# EAGLE design chuveiro (EAGLE 7.2.0)
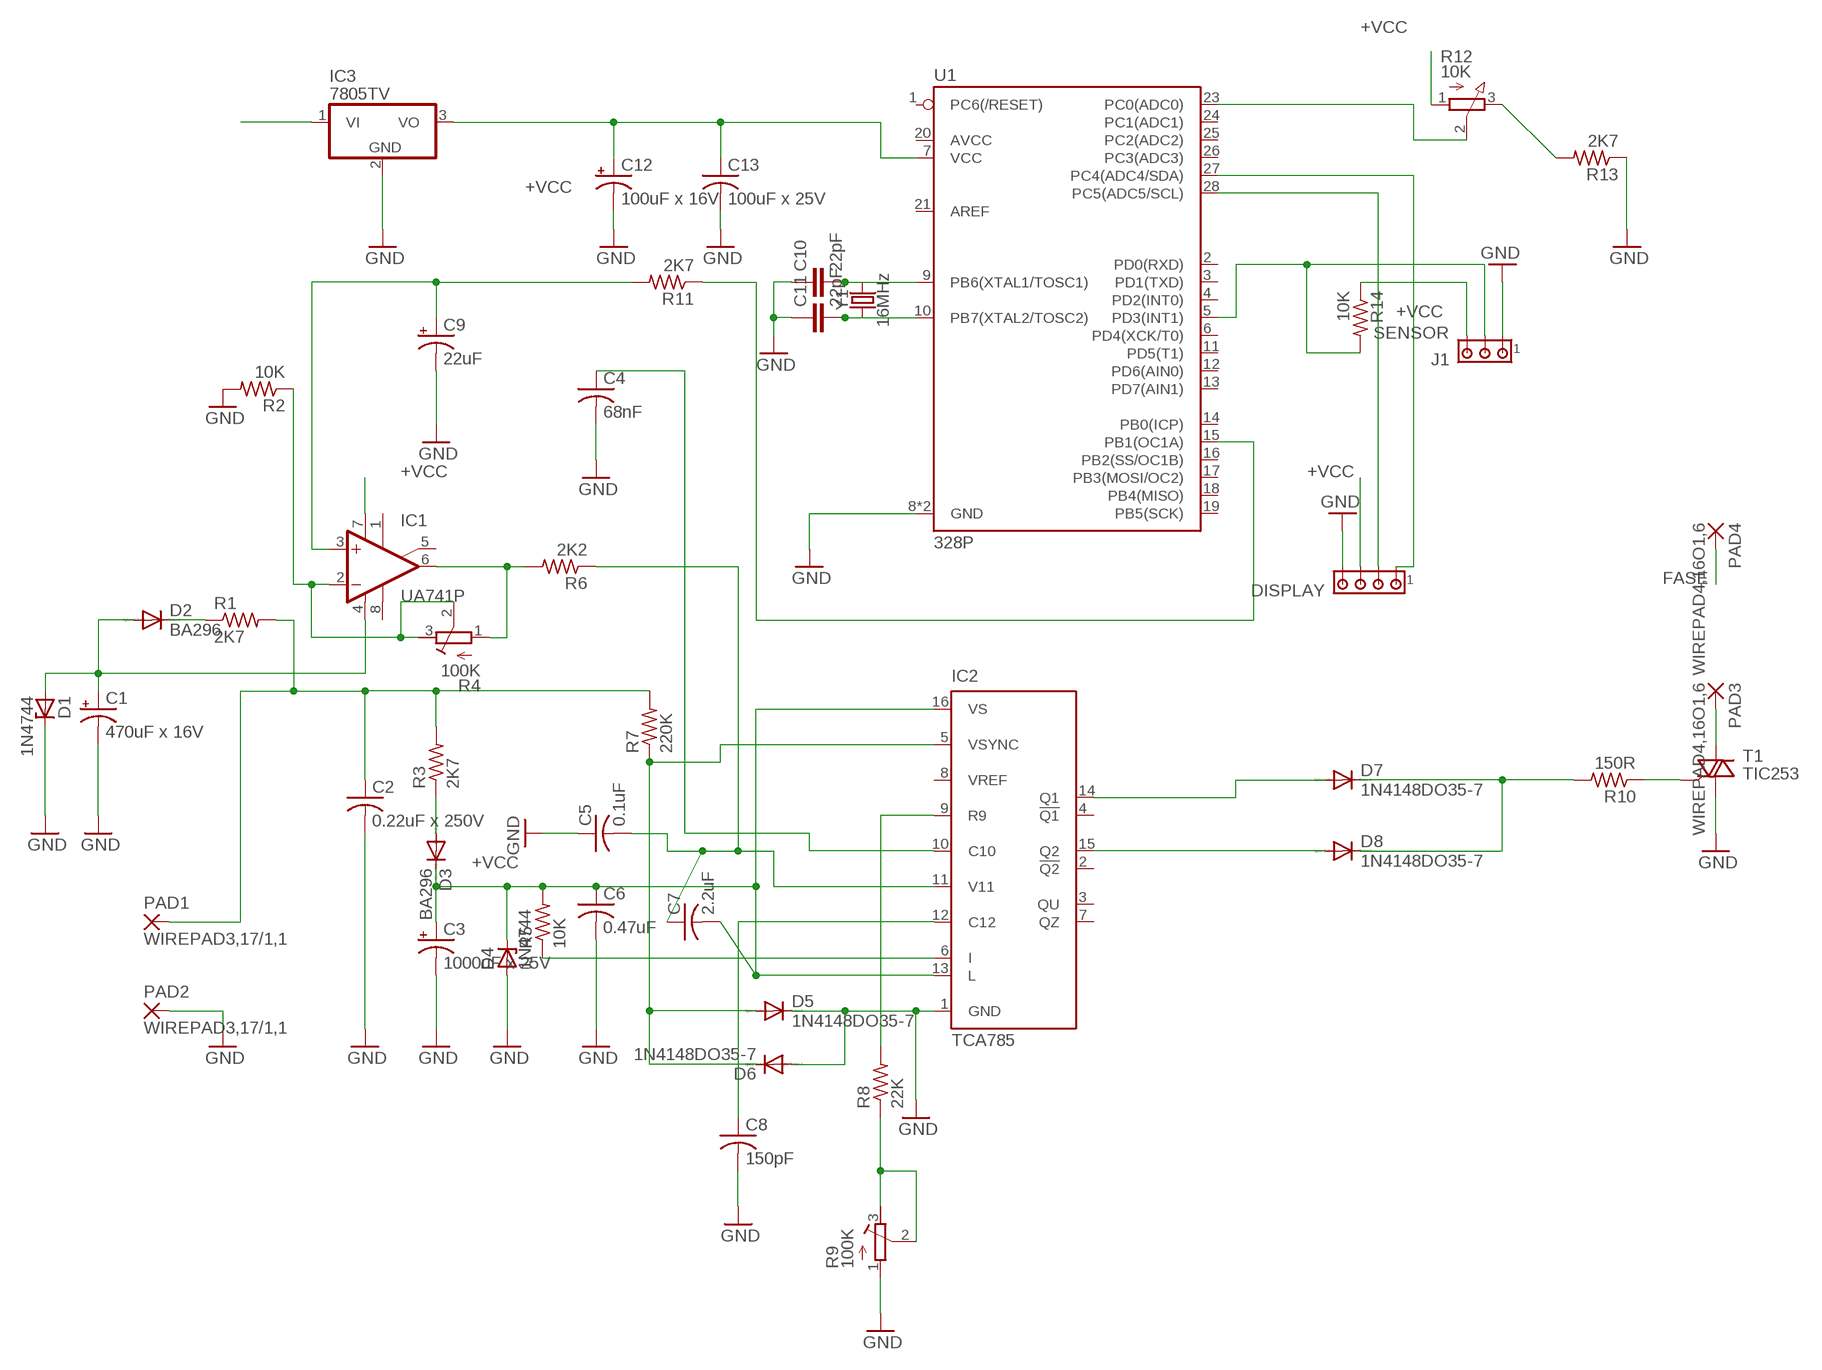
[diagram p0: schematic, sheet 1]

## Parts
C1  470uF x 16V  CPOL-USE5-6  [E5-6]
C2  0.22uF x 250V  C-US225-062X268  [C225-062X268]
C3  1000uF x 25V  CPOL-USE5-6  [E5-6]
C4  68nF  C-US025-050X050  [C025-050X050]
C5  0.1uF  C-US025-050X050  [C025-050X050]
C6  0.47uF  C-US025-050X050  [C025-050X050]
C7  2.2uF  C-US025-050X050  [C025-050X050]
C8  150pF  C-US025-050X050  [C025-050X050]
C9  22uF  CPOL-USE5-6  [E5-6]
C10  22pF  C-EU025-024X044  [C025-024X044]
C11  22pF  C-EU025-024X044  [C025-024X044]
C12  100uF x 16V  CPOL-USE5-6  [E5-6]
C13  100uF x 25V  C-US225-062X268  [C225-062X268]
D1  1N4744  ZENER-DIODEDO41Z10  [DO41Z10]
D2  BA296  [P2-15]
D3  BA296  [P2-15]
D4  1N4744  ZENER-DIODEDO41Z10  [DO41Z10]
D5  1N4148DO35-7  [DO35-7]
D6  1N4148DO35-7  [DO35-7]
D7  1N4148DO35-7  [DO35-7]
D8  1N4148DO35-7  [DO35-7]
DISPLAY  MTA04-100  [10X04MTA]
IC1  UA741P  [DIL08]
IC2  TCA785  [DIL16]
IC3  7805TV  [TO220V]
J1  SENSOR  MTA03-100  [10X03MTA]
PAD1  WIREPAD3,17/1,1  [3,17/1,1]
PAD2  WIREPAD3,17/1,1  [3,17/1,1]
PAD3  WIREPAD4,16O1,6  [4,16O1,6]
PAD4  WIREPAD4,16O1,6  [4,16O1,6]
R1  2K7  R-US_0207/10  [0207/10]
R2  10K  R-US_0207/10  [0207/10]
R3  2K7  R-US_0207/10  [0207/10]
R4  100K  R-TRIMM64Y  [RTRIM64Y]
R5  10K  R-US_0207/10  [0207/10]
R6  2K2  R-US_0207/10  [0207/10]
R7  220K  R-US_0207/10  [0207/10]
R8  22K  R-US_0207/10  [0207/10]
R9  100K  R-TRIMM64Y  [RTRIM64Y]
R10  150R  R-US_0207/10  [0207/10]
R11  2K7  R-US_0207/10  [0207/10]
R12  10K  3RP/1610N  [3RP/1610N]
R13  2K7  R-US_0207/10  [0207/10]
R14  10K  R-US_0207/10  [0207/10]
T1  TIC253  [TO218DS]
U1  328P  ATMEGA328P_PDIP  [DIP28]
Y1  16MHz  CRYSTAL-16MHZPTH-HC49US  [HC49US]

## Nets
+VCC: C3.+ C6.1 C7.2 D3.C D4.C DISPLAY.3 IC1.7(V+) IC2.13(L) IC2.16(VS) IC3.1(VI) J1.3 R5.2 R12.1(A) R14.1
FASE: C2.1 PAD1.1(P) PAD4.1(P) R1.2 R3.2 R7.2
GND: C1.- C2.2 C3.- C4.2 C5.1 C6.2 C8.2 C9.- C10.1 C11.1 C12.- C13.2 D1.C D4.A D5.C D6.A DISPLAY.4 IC2.1(GND) IC3.2(GND) J1.1 PAD2.1(P) R2.2 R9.1(A) R13.1 T1.A1 U1.8(GND) U1.22(GND)
N$1: D3.A R3.1
N$2: C8.1 IC2.12(C12)
N$3: R11.1 U1.15(PB1(OC1A))
N$5: D5.A D6.C IC2.5(VSYNC) R7.1
N$6: IC2.6(I) R5.1
N$7: C9.+ IC1.3(+IN) R11.2
N$8: C5.2 C7.1 IC2.11(V11) R6.1
N$9: C11.2 U1.10(PB7(XTAL2/TOSC2)) Y1.1
N$10: C4.1 IC2.10(C10)
N$11: D7.A IC2.14(Q1)
N$12: D8.A IC2.15(Q2)
N$13: D7.C D8.C R10.2
N$14: R10.1 T1.G
N$15: R8.1 R9.2(S) R9.3(E)
N$16: IC2.9(R9) R8.2
N$17: IC1.6(OUT) R4.1(A) R6.2
N$18: D2.C R1.1
N$19: C1.+ D1.A D2.A IC1.4(V-)
N$20: IC1.2(-IN) R2.1 R4.2(S) R4.3(E)
N$21: C10.2 U1.9(PB6(XTAL1/TOSC1)) Y1.2
N$22: R12.3(E) R13.2
N$23: R12.2(S) U1.23(PC0(ADC0))
N$24: C12.+ C13.1 IC3.3(VO) U1.7(VCC)
N$25: J1.2 R14.2 U1.5(PD3(INT1))
N$26: DISPLAY.2 U1.28(PC5(ADC5/SCL))
N$27: DISPLAY.1 U1.27(PC4(ADC4/SDA))
N$28: PAD3.1(P) T1.A2
Unconnected: IC1.1(ON1) IC1.5(ON2) IC1.8(OPT) IC2.2(!Q2) IC2.3(QU) IC2.4(!Q1) IC2.7(QZ) IC2.8(VREF) U1.1(PC6(/RESET)) U1.2(PD0(RXD)) U1.3(PD1(TXD)) U1.4(PD2(INT0)) U1.6(PD4(XCK/T0)) U1.11(PD5(T1)) U1.12(PD6(AIN0)) U1.13(PD7(AIN1)) U1.14(PB0(ICP)) U1.16(PB2(SS/OC1B)) U1.17(PB3(MOSI/OC2)) U1.18(PB4(MISO)) U1.19(PB5(SCK)) U1.20(AVCC) U1.21(AREF) U1.24(PC1(ADC1)) U1.25(PC2(ADC2)) U1.26(PC3(ADC3))

## Library data of the parts
C1 C3 C9 C12 = rcl:CPOL-US: POLARIZED CAPACITOR, American symbol
C2 C4-C8 C13 = rcl:C-US: CAPACITOR, American symbol
C10 C11 = rcl:C-EU: CAPACITOR, European symbol
D1 D4 = diode:ZENER-DIODE: Z-Diode
D2 D3 = diode:BA296: DIODE
D5-D8 = diode:1N4148: DIODE high speed (Philips)
DISPLAY = con-amp:MTA04-100: AMP connector
IC1 = linear:*741: OP AMP
IC2 = infineon:TCA785: Phase Control IC Source: http://www.infineon.com/ .. tca785.pdf; OC_FARNELL: unknown; OC_NEWARK: unknown
IC3 = linear:78*: Positive VOLTAGE REGULATOR Source: http://cache.national.com/ds/LM/LM78L05.pdf http://www.fairchildsemi.com/ds/LM/LM7805.pdf
J1 = con-amp:MTA03-100: AMP connector
PAD1-PAD4 = wirepad:WIREPAD: Wire PAD connect wire on PCB
R1-R3 R5-R8 R11 R13 R14 = rcl:R-US_: RESISTOR, American symbol
R4 R9 = rcl:R-TRIMM: Trimm resistor
R10 = resistor:R-US_: RESISTOR, American symbol
R12 = pot:3RP/1610N: 16mm Potentiometer one level Source: http://www.alphapotentiometers.net/html/16mm_pot_2.html
T1 = triac:TIC253: TRIAC
U1 = SparkFun-IC-Microcontroller:ATMEGA328P_PDIP: Atmel 328P Through hole ATMEGA328P uC used in the Arduino 32kb flash, 1k EEPROM, 2k SRAM Datasheet <http://www.sparkfun.com/datasheets/Components/SMD/ATMega328.pdf> SparkFun Products Storefront component: AVR 28 Pin 20MHz 32K 6A/D - ATMega328P <https://www.sparkfun.com/products/9061> (COM-09061) SparkFun Simon Says - Through-Hole Soldering Kit <https://www.sparkfun.com/products/10547> (KIT-10547) SparkFun Learn to Solder - Simon Says <https://www.sparkfun.com/products/13708> (KIT-13708) SparkFun BigTime Watch Kit <https://www.sparkfun.com/products/11734> (KIT-11734) SparkFun ClockIt <https://www.sparkfun.com/products/10930> (KIT-10930) SparkFun Serial Enabled LCD Kit <https://www.sparkfun.com/products/10097> (LCD-10097) SparkFun Simon Tilts - Through Hole Soldering Kit <https://www.sparkfun.com/products/12634> (KIT-12634) SparkFun Frequency Counter Kit <https://www.sparkfun.com/products/10140> (KIT-10140) FabFM Radio Kit <https://www.sparkfun.com/products/11043> (KIT-11043) SparkFun Binary Blaster Kit <https://www.sparkfun.com/products/12037> (KIT-12037) SparkFun Metro-Gnome <https://www.sparkfun.com/products/9236> (KIT-09236) ATmega328 with Arduino Optiboot (Uno) <https://www.sparkfun.com/products/10524> (DEV-10524); PROD_ID: IC-09136
Y1 = SparkFun-Clocks:CRYSTAL-16MHZ: 16MHz Crystal Digikey Example <http://www.digikey.com/product-search/en?keywords=535-9122-1-ND> Frequency: 16MHz Frequency Stability: ±50ppm Frequency Tolerance: ±20ppm Load Capacitance: 18pF SparkFun Products: Pro Micro -5V/16MHz <https://www.sparkfun.com/products/12640> SparkFun Serial Enabled LCD Kit <https://www.sparkfun.com/products/10097>; PROD_ID: XTAL-08181; SF_ID: COM-00536

## Board
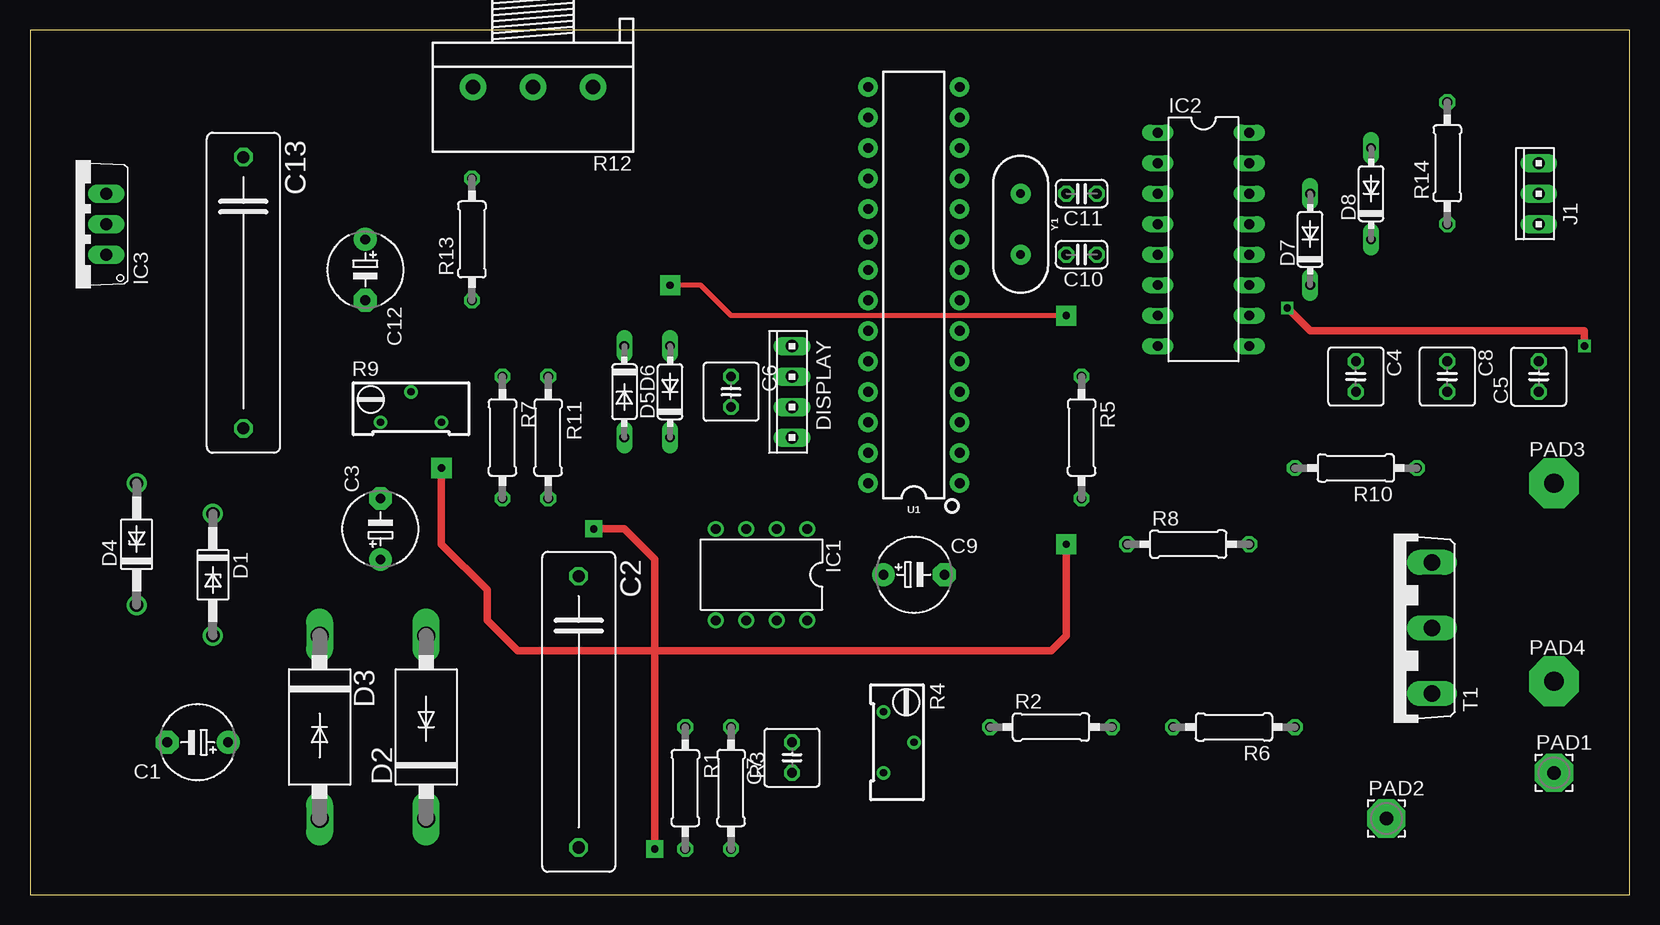
[diagram p1: board, top side]
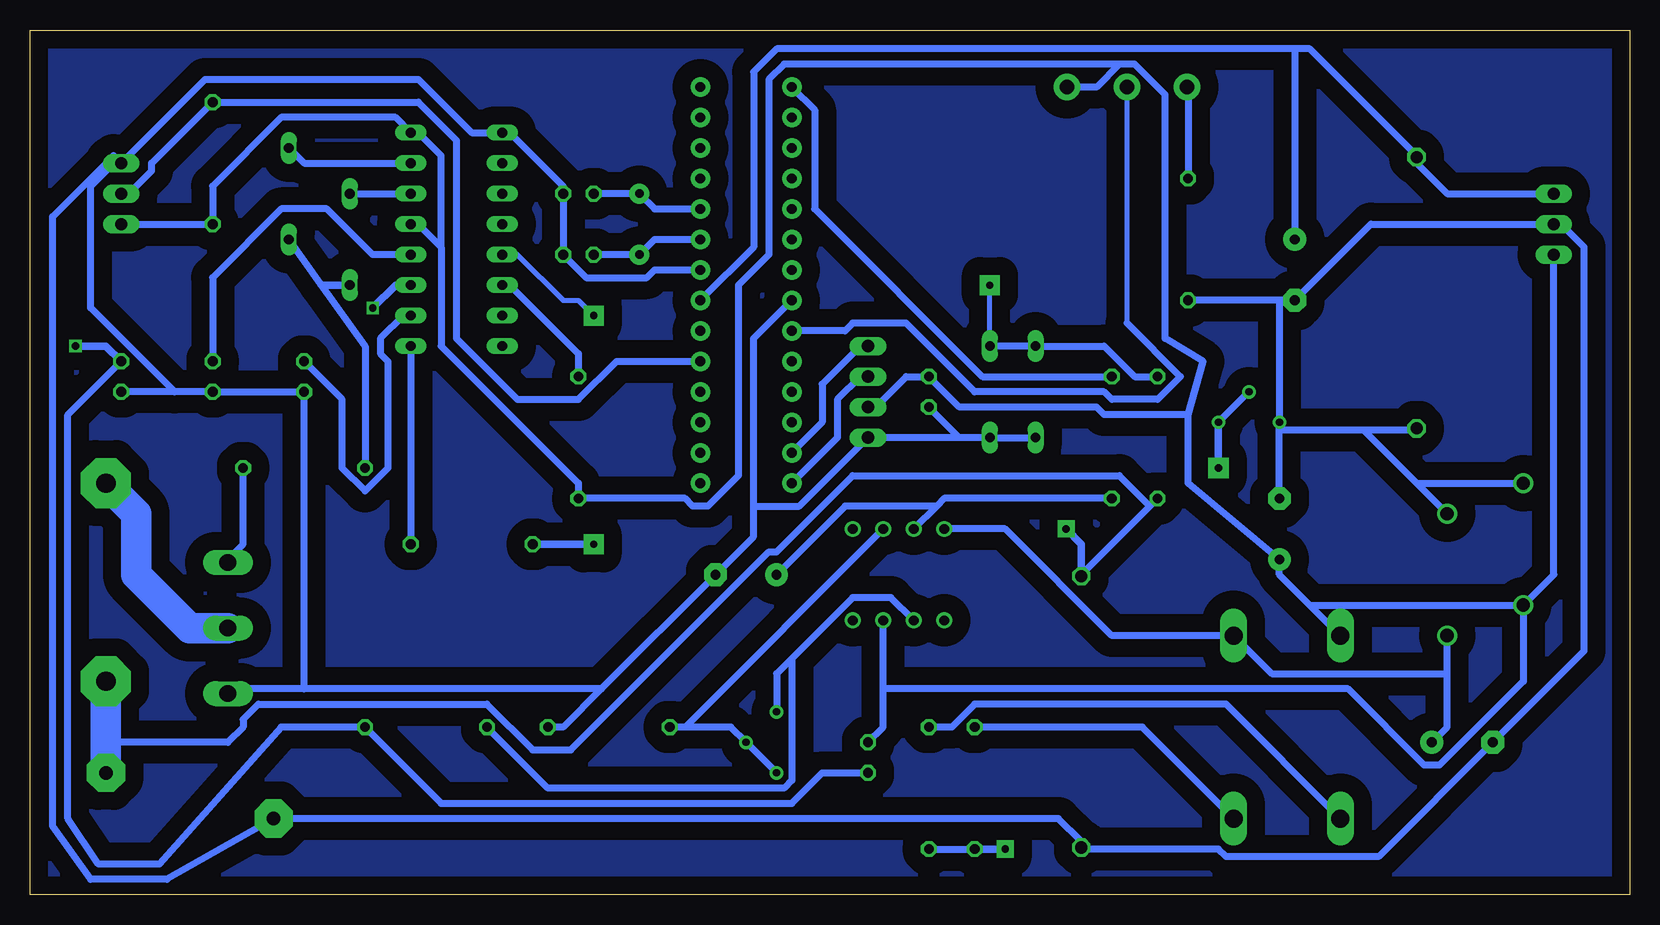
[diagram p2: board, bottom side, seen from below]

Size 133.33 x 72.06 mm. Coordinates in mm from the lower left corner, seen from the top.
Outline: 0,0 133.33,0 133.33,72.06 0,72.06 0,0
Copper layers (1*16): Top 0.035mm / dielectric 1.5mm / Bottom 0.035mm
Design rules "default *": minimum track width 0.6mm, minimum drill 24mil, track to track 15mil, track to pad 10mil, pad to pad 8mil, via to via 8mil, smd to smd 8mil, copper to edge 40mil, drill to drill 8mil, minimum pad ring 10mil, minimum via ring 8mil, stop-mask expansion 4mil, vias tented up to drill 0mil, thermal gap 10mil

### Footprints (pad centres in the part's own frame; a part is rotated, then mirrored left to right if it is on the bottom)
E5-6 = drill 0.813 pad 1.905: + -2.54,0 | drill 0.813 pad 1.905 octagon: - 2.54,0
C225-062X268 = drill 1.016 octagon: 1 -11.303,0; 2 11.303,0
C025-050X050 = drill 0.813 octagon: 1 -1.27,0; 2 1.27,0
C025-024X044 = drill 0.813 octagon: 1 -1.27,0; 2 1.27,0
DO41Z10 = drill 1.118: A 5.08,0; C -5.08,0
P2-15 = drill 1.499 long: A 7.62,0; C -7.62,0
DO35-7 = drill 0.813 long: A 3.81,0; C -3.81,0
10X04MTA = drill 1.016 long: 1 3.81,0; 2 1.27,0; 3 -1.27,0; 4 -3.81,0
DIL08 = drill 0.813 pad 1.27: 1 -3.81,-3.81; 2 -1.27,-3.81; 3 1.27,-3.81; 4 3.81,-3.81; 5 3.81,3.81; 6 1.27,3.81; 7 -1.27,3.81; 8 -3.81,3.81
DIL16 = drill 0.813 long: 1 -8.89,-3.81; 2 -6.35,-3.81; 3 -3.81,-3.81; 4 -1.27,-3.81; 5 1.27,-3.81; 6 3.81,-3.81; 7 6.35,-3.81; 8 8.89,-3.81; 9 8.89,3.81; 10 6.35,3.81; 11 3.81,3.81; 12 1.27,3.81; 13 -1.27,3.81; 14 -3.81,3.81; 15 -6.35,3.81; 16 -8.89,3.81
TO220V = drill 1.016 long: 1 -2.54,-2.54; 2 0,-2.54; 3 2.54,-2.54
10X03MTA = drill 1.016 long: 1 2.54,0; 2 0,0; 3 -2.54,0
3,17/1,1 = drill 1.118 pad 3.175 octagon: 1 0,0
4,16O1,6 = drill 1.6 pad 4.166 octagon: 1 0,0
0207/10 = drill 0.813 octagon: 1 -5.08,0; 2 5.08,0
RTRIM64Y = drill 0.61: 1 0,-2.54; 2 -2.54,0; 3 0,2.54
3RP/1610N = drill 1.2 pad 2.184: 1 -5,0; 2 0,0; 3 5,0
TO218DS = drill 1.397 long: A1 -5.461,-3.175; A2 0,-3.175; G 5.461,-3.175
DIP28 = drill 0.813 pad 1.626: 1 -16.51,-3.81; 2 -13.97,-3.81; 3 -11.43,-3.81; 4 -8.89,-3.81; 5 -6.35,-3.81; 6 -3.81,-3.81; 7 -1.27,-3.81; 8 1.27,-3.81; 9 3.81,-3.81; 10 6.35,-3.81; 11 8.89,-3.81; 12 11.43,-3.81; 13 13.97,-3.81; 14 16.51,-3.81; 15 16.51,3.81; 16 13.97,3.81; 17 11.43,3.81; 18 8.89,3.81; 19 6.35,3.81; 20 3.81,3.81; 21 1.27,3.81; 22 -1.27,3.81; 23 -3.81,3.81; 24 -6.35,3.81; 25 -8.89,3.81; 26 -11.43,3.81; 27 -13.97,3.81; 28 -16.51,3.81
HC49US = drill 0.7 pad 1.651: 1 -2.54,0; 2 2.54,0

### Placement (x,y rotation side)
C1  13.97,12.7 180 top
C2  45.72,15.24 270 top
C3  29.21,30.48 90 top
C4  110.49,43.18 270 top
C5  125.73,43.18 90 top
C6  58.42,41.91 270 top
C7  63.5,11.43 90 top
C8  118.11,43.18 270 top
C9  73.66,26.67 0 top
C10  87.63,53.34 180 top
C11  87.63,58.42 180 top
C12  27.94,52.07 270 top
C13  17.78,50.16 270 top
D1  15.24,26.67 270 top
D2  33.02,13.97 90 top
D3  24.13,13.97 270 top
D4  8.89,29.21 90 top
D5  53.34,41.91 90 top
D6  49.53,41.91 270 top
D7  106.68,54.61 90 top
D8  111.76,58.42 90 top
DISPLAY  63.5,41.91 90 top
IC1  60.96,26.67 180 top
IC2  97.79,54.61 270 top
IC3  3.81,55.88 90 top
J1  125.73,58.42 90 top
PAD1  127,10.16 0 top
PAD2  113.03,6.35 0 top
PAD3  127,34.29 0 top
PAD4  127,17.78 0 top
R1  54.61,8.89 270 top
R2  85.09,13.97 0 top
R3  58.42,8.89 270 top
R4  71.12,12.7 180 top
R5  87.63,38.1 270 top
R6  100.33,13.97 180 top
R7  39.37,38.1 270 top
R8  96.52,29.21 0 top
R9  31.75,39.37 270 top
R10  110.49,35.56 180 top
R11  43.18,38.1 270 top
R12  41.91,67.31 180 top
R13  36.83,54.61 90 top
R14  118.11,60.96 90 top
T1  113.67,22.23 90 top
U1  73.66,50.8 90 top
Y1  82.55,55.88 270 top

### Tracks (layer width: path | path; a pad name or v marks a point on that pad's centre or on a via)
+VCC
  Bottom 0.6: 62.23,17.15 62.23,13.97 C7.2 | 62.23,17.15 IC1.7 | IC3.1 6.35,26.67 D4.C | 62.23,17.15 23.5,17.15 17.14,10.79 15.88,10.79 8.89,17.78 D4.C | J1.3 R14.1 118.11,59.05 112.4,64.77 102.87,64.77 IC2.16 100.97,63.5 99.06,61.59 99.06,53.98 | 99.06,53.98 99.06,45.72 87.63,34.29 R5.2 78.74,33.02 78.11,32.38 76.84,32.38 74.3,34.92 74.3,50.8 71.76,53.34 71.76,67.95 70.48,69.22 42.54,69.22 | 99.06,53.98 100.97,55.88 IC2.13 | DISPLAY.3 62.87,40.64 60.32,43.18 C6.1 55.88,40.64 44.45,40.64 43.81,40 36.83,40 | D3.C 26.67,24.13 | 26.67,24.13 29.21,26.67 C3.+ 36.83,34.29 36.83,40 | R12.1 44.45,67.31 42.54,69.22 | 42.54,69.22 41.27,69.22 38.73,66.68 38.73,46.35 35.56,44.45 36.83,40 | 26.67,24.13 D4.C
FASE  (via drill 0.6 pad 1.42)
  Top 0.61: v46.99,30.48 49.53,30.48 52.07,27.94 v52.07,3.81
  Bottom 0.6: 40,32.38 45.72,26.67 C2.1 | 40,32.38 R7.2 | 40,32.38 42.54,34.92 64.77,34.92 71.12,28.57 71.76,28.57 88.27,12.06 91.44,12.06 95.25,15.88 114.3,15.88 115.57,14.6 115.57,13.97 116.84,12.7 127,12.7 | R3.2 R1.2
  Bottom 0.61: C2.1 45.72,29.21 v46.99,30.48 | v52.07,3.81 R1.2
  Bottom 2.54: PAD1.1 127,12.7 PAD4.1
GND
  Bottom 0.6: U1.8 81.28,52.07 81.92,51.43 87,51.43 C10.1 C11.1 88.9,59.05 93.34,63.5 IC2.1 96.52,63.5 100.97,67.95 118.75,67.95 J1.1 | 121.29,41.91 C8.2 C4.2 110.49,17.15 | 121.29,41.91 C5.1 | J1.1 126.37,60.96 128.27,59.05 128.27,48.89 121.29,41.91 | D6.A D5.C 55.88,38.1 | 55.88,38.1 C6.2 | 55.88,38.1 DISPLAY.4 69.22,32.38 73.03,32.38 | R2.2 88.9,13.97 85.73,17.15 | 85.73,17.15 C9.- 73.03,29.84 73.03,32.38 | U1.22 73.03,46.35 73.03,32.38 | 85.73,17.15 110.49,17.15 | 110.49,17.15 116.84,17.15 T1.A1 | C3.- 29.21,38.73 | 29.21,38.73 22.23,38.73 | 22.23,38.73 17.78,38.73 C13.2 | 29.21,38.73 R9.1 29.21,49.53 | 22.23,38.73 17.78,34.29 | 17.78,34.29 D1.C | 17.78,34.29 D4.A | 29.21,49.53 C12.- 21.59,55.88 IC3.2 5.71,55.88 3.81,53.98 3.81,20.32 C1.- 20.96,3.18 33.65,3.18 34.29,3.81 45.72,3.81 C2.2 45.72,4.45 47.62,6.35 PAD2.1 121.92,1.27 128.27,1.27 131.44,5.71 131.44,56.52 126.37,61.59 J1.1 | 29.21,49.53 R13.1
N$1
  Bottom 0.6: R3.1 56.51,13.97 54.61,15.88 33.65,15.88 D3.A
N$2
  Bottom 0.6: C8.1 118.11,51.43 112.4,57.15 108.59,57.15 104.78,53.34 IC2.12
N$3
  Bottom 0.6: R11.1 53.97,43.18 67.95,57.15 67.95,65.41 U1.15
N$4  (via drill 0.6 pad 1.68)
  other vias: 86.36,48.26
N$5  (via drill 0.6 pad 1.68)  (1 unrouted)
  Top 0.406: v86.36,48.26 58.42,48.26 55.88,50.8 53.34,50.8
  Bottom 0.406: D5.A 53.34,50.8 | IC2.5 92.71,53.34 88.9,49.53 87.63,49.53 v86.36,48.26
  Bottom 0.6: R7.1 41.27,43.18 43.81,45.72 D6.C D5.A
N$6
  Bottom 0.6: R5.1 87.63,45.09 93.34,50.8 IC2.6
N$7
  Bottom 0.6: 57.78,32.38 57.15,33.02 R11.2 | 57.78,32.38 IC1.3 | C9.+ 65.41,32.38 57.78,32.38
N$8  (via drill 0.6 pad 1.02)
  Top 0.61: v104.78,48.89 106.68,46.99 129.54,46.99 v129.54,45.72
  Bottom 0.6: C7.1 67.31,10.16 69.85,7.62 99.06,7.62 R6.1 112.4,13.97 122.56,2.54 127.64,2.54 130.17,6.35 130.17,40 C5.2
  Bottom 0.61: IC2.11 102.87,50.8 v104.78,48.89 | v129.54,45.72 127,45.72 C5.2
N$9
  Bottom 0.6: C11.2 Y1.1 81.28,57.15 U1.10
N$10
  Bottom 0.6: C4.1 107.31,41.27 107.31,35.56 105.41,33.66 103.51,35.56 103.51,44.45 104.14,45.09 104.14,46.35 102.23,48.26 IC2.10
N$11
  Bottom 0.6: D7.A IC2.14
N$12
  Bottom 0.6: IC2.15 110.49,60.96 D8.A
N$13
  Bottom 0.6: R10.2 105.41,45.72 109.1,50.89 D8.C
  Bottom 0.61: D7.C 109.01,50.8 109.1,50.89
N$14
  Bottom 0.6: R10.1 115.57,29.21 116.84,27.94 T1.G
N$15  (via drill 0.6 pad 1.68)
  Top 0.61: v86.36,29.21 86.36,21.59 85.09,20.32 40.64,20.32 38.1,22.86 38.1,25.4 34.29,29.21 v34.29,35.56
  Bottom 0.6: R9.3 R9.2
  Bottom 0.61: R8.1 v86.36,29.21 | v34.29,35.56 R9.3
N$16
  Bottom 0.6: IC2.9 R8.2
N$17
  Bottom 0.6: R4.1 71.12,18.41 69.85,19.69 | 69.85,19.69 64.77,24.77 61.59,24.77 IC1.6 | R6.2 90.17,8.89 70.48,8.89 69.85,9.53 69.85,19.69
N$18
  Bottom 0.6: R1.1 40.64,13.97 D2.C
N$19
  Bottom 0.6: 15.24,18.41 15.24,13.97 C1.+ | 15.24,18.41 D1.A | IC1.4 52.07,30.48 43.18,21.59 D2.A 29.84,18.41 15.24,18.41
N$20
  Bottom 0.6: R4.3 R4.2 74.93,13.97 78.74,13.97 | 78.74,13.97 R2.1 | 78.74,13.97 IC1.2
N$21
  Bottom 0.6: C10.2 Y1.2 81.28,54.61 U1.9
N$22
  Bottom 0.6: R13.2 36.83,67.31 R12.3
N$23
  Bottom 0.406: 41.91,47.62 R12.2
  Bottom 0.6: U1.23 65.41,46.99 64.77,47.62 60.32,47.62 54.61,41.91 43.81,41.91 43.18,41.27 39.37,41.27 37.46,43.18 41.91,47.62
N$24
  Bottom 0.6: U1.7 73.03,53.98 73.03,68.58 71.12,70.48 27.94,70.48 | 27.94,70.48 26.67,70.48 17.78,61.59 C13.1 17.78,60.96 15.24,58.42 IC3.3 | 27.94,70.48 C12.+
N$25
  Bottom 0.6: J1.2 125.09,58.42 123.19,60.32 123.19,60.96 R14.2 100.97,66.04 97.79,62.87 97.79,46.35 92.71,41.27 87.63,41.27 84.45,44.45 U1.5
N$26
  Bottom 0.6: U1.28 66.04,38.1 66.04,41.27 64.14,43.18 DISPLAY.2
N$27
  Bottom 0.6: U1.27 67.31,39.37 67.31,42.55 64.14,45.72 DISPLAY.1
N$28
  Bottom 2.54: T1.A2 120.02,22.23 124.46,26.67 124.46,31.75 PAD3.1
N$29  (via drill 0.6 pad 1.68)
  other vias: 53.34,50.8
N$30  (via drill 0.6 pad 1.68)
  other vias: 34.29,35.56
N$31  (via drill 0.6 pad 1.68)
  other vias: 86.36,29.21
N$32  (via drill 0.6 pad 1.02)
  other vias: 104.78,48.89
N$33  (via drill 0.6 pad 1.02)
  other vias: 129.54,45.72
N$34  (via drill 0.6 pad 1.42)
  other vias: 52.07,3.81
N$35  (via drill 0.6 pad 1.42)
  other vias: 46.99,30.48
N$36
  pour Bottom (isolate 1.5): 0,72.39 133.35,72.39 133.35,0 0,0